# EAGLE design AD595_thermocouple_breakout_board (EAGLE 6.1)
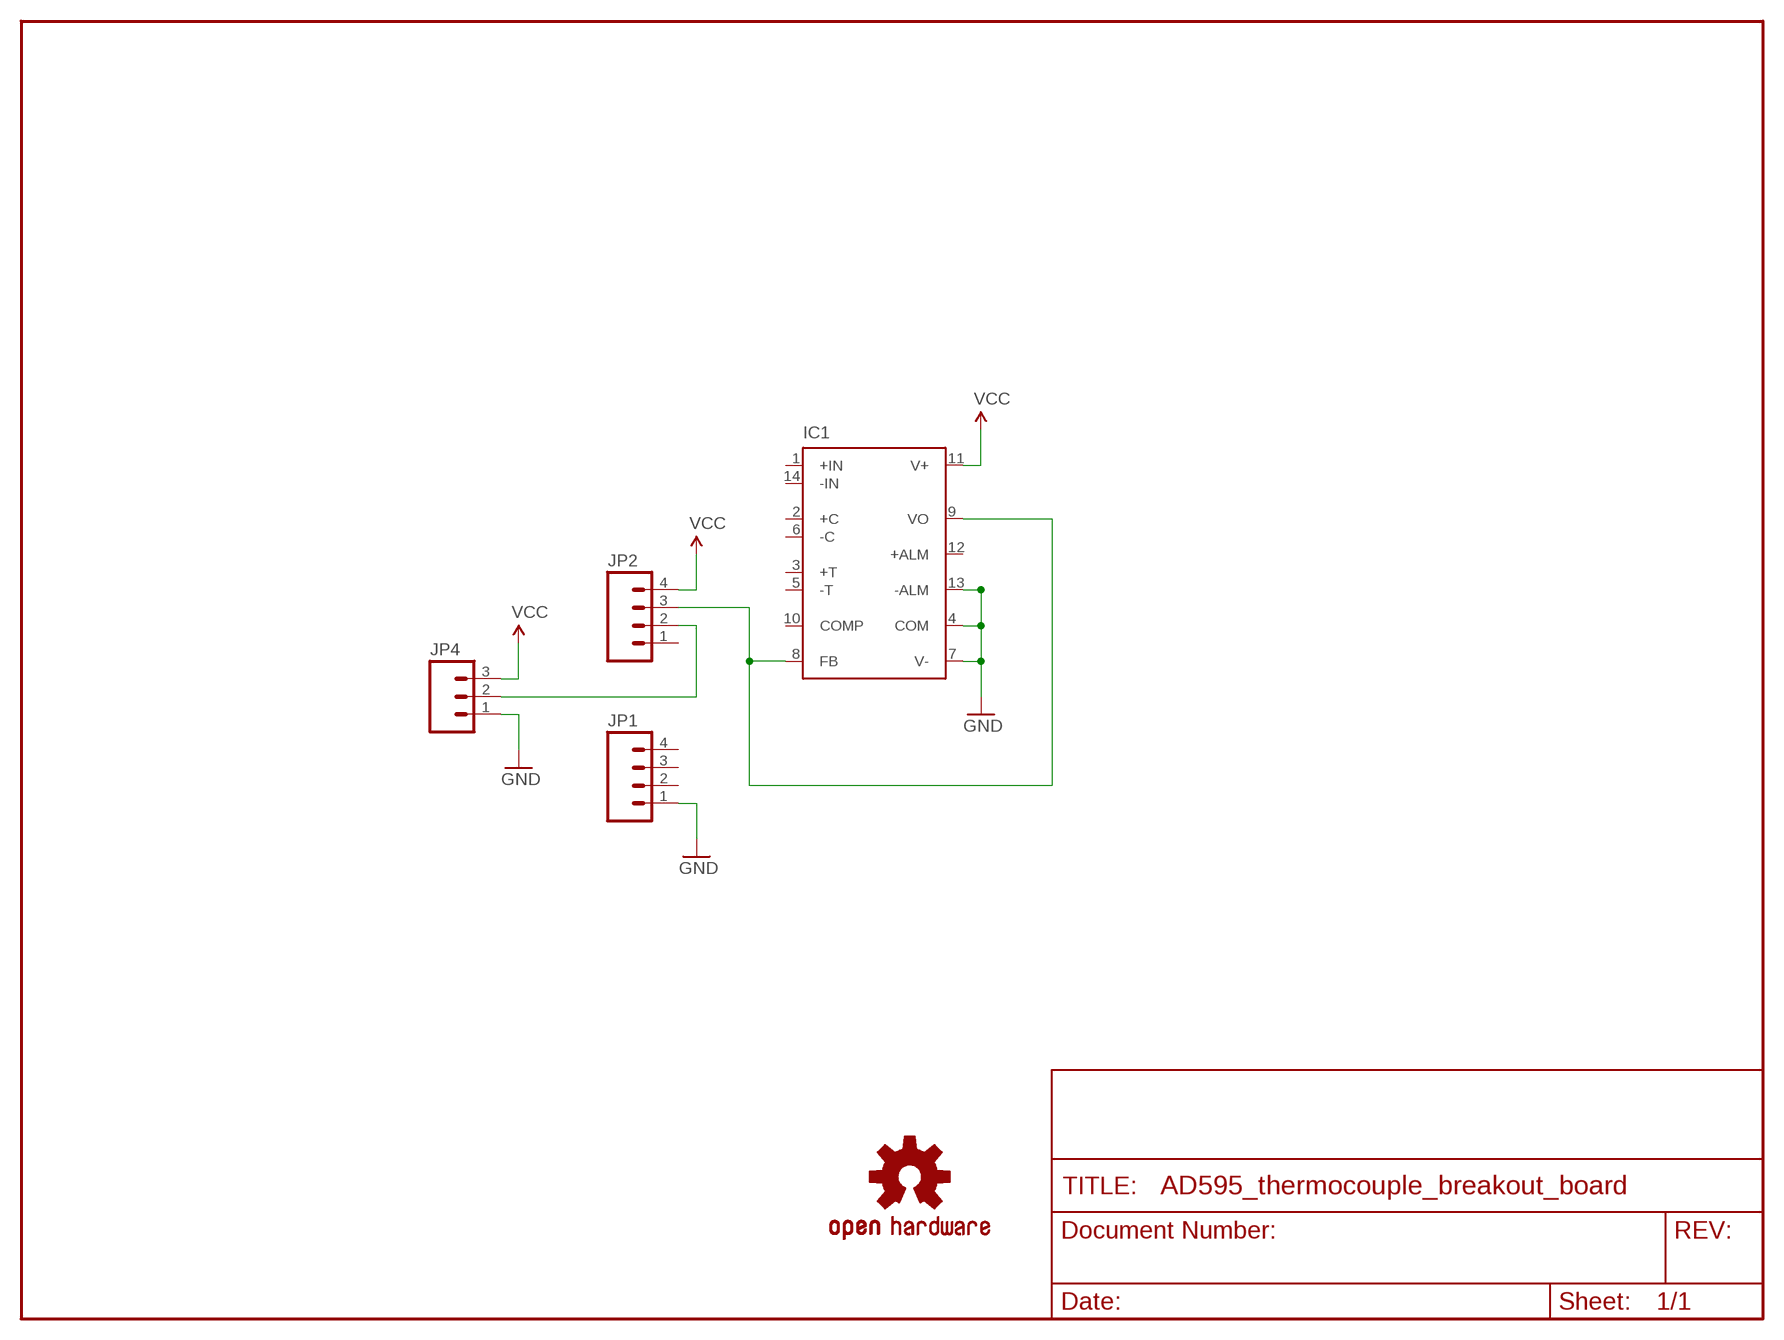
[diagram p0: schematic, sheet 1]

## Parts
IC1  AD595  [DIL14]
JP1  M04LOCK  [1X04_LOCK]
JP2  M04LOCK  [1X04_LOCK]
JP4  M03LOCK  [1X03_LOCK]
U$1  OSHW-LOGOS  [OSHW-LOGO-S]

## Nets
GND: IC1.4(COM) IC1.7(V-) IC1.13(-ALM) JP1.1 JP4.1
N$1: JP2.2 JP4.2
N$2: IC1.8(FB) IC1.9(VO) JP2.3
VCC: IC1.11(V+) JP2.4 JP4.3
Unconnected: IC1.1(+IN) IC1.2(+C) IC1.3(+T) IC1.5(-T) IC1.6(-C) IC1.10(COMP) IC1.12(+ALM) IC1.14(-IN) JP1.2 JP1.3 JP1.4 JP2.1

## Library data of the parts
IC1 = analog-devices:AD595: ANALOG DEVICES; MPN: AD595AQ; OC_FARNELL: 409194; OC_NEWARK: 06WX1596
JP1 JP2 = SparkFun:M04: Header 4 Standard 4-pin 0.1" header. Use with straight break away headers (SKU : PRT-00116), right angle break away headers (PRT-00553), swiss pins (PRT-00743), machine pins (PRT-00117), and female headers (PRT-00115). Molex polarized connector foot print use with SKU : PRT-08231 with associated crimp pins and housings. 1MM SMD Version SKU: PRT-10208
JP4 = SparkFun:M03: Header 3 Standard 3-pin 0.1" header. Use with straight break away headers (SKU : PRT-00116), right angle break away headers (PRT-00553), swiss pins (PRT-00743), machine pins (PRT-00117), and female headers (PRT-00115). Molex polarized connector foot print use with SKU : PRT-08232 with associated crimp pins and housings.
U$1 = SparkFun:OSHW-LOGO: Open Source Hardware Logo This logo indicates the piece of hardware it is found on incorporates a OSHW license and/or adheres to the definition of open source hardware found here: http://freedomdefined.org/OSHW

## Board
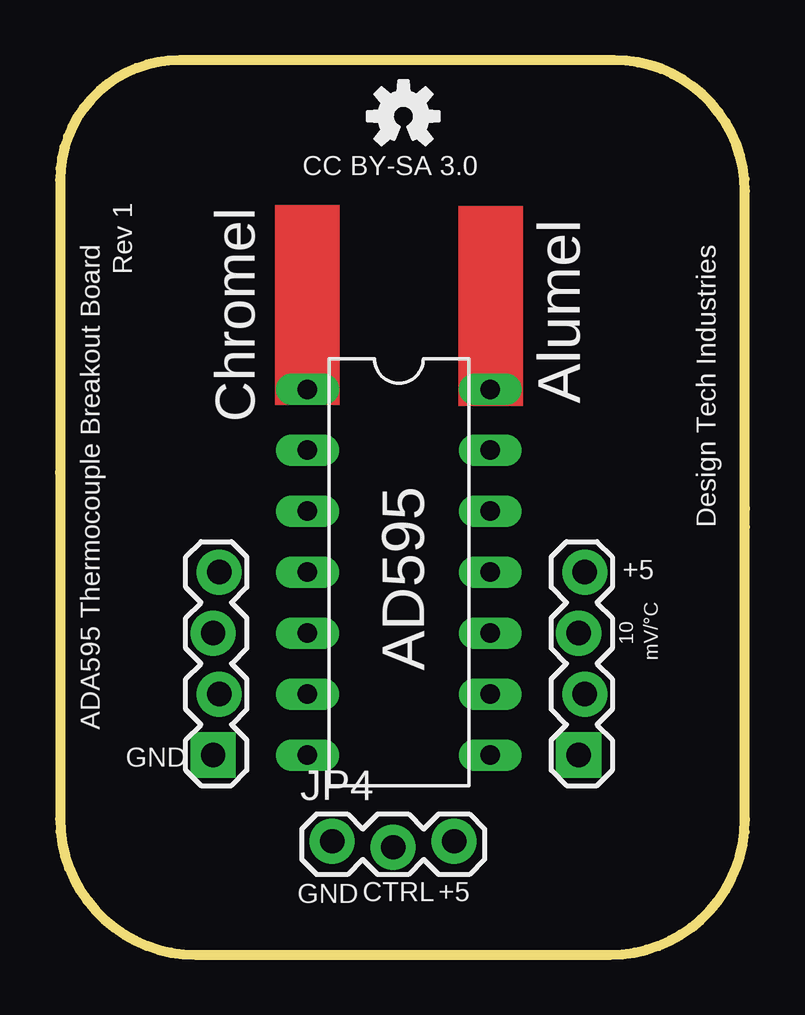
[diagram p1: board, top side]
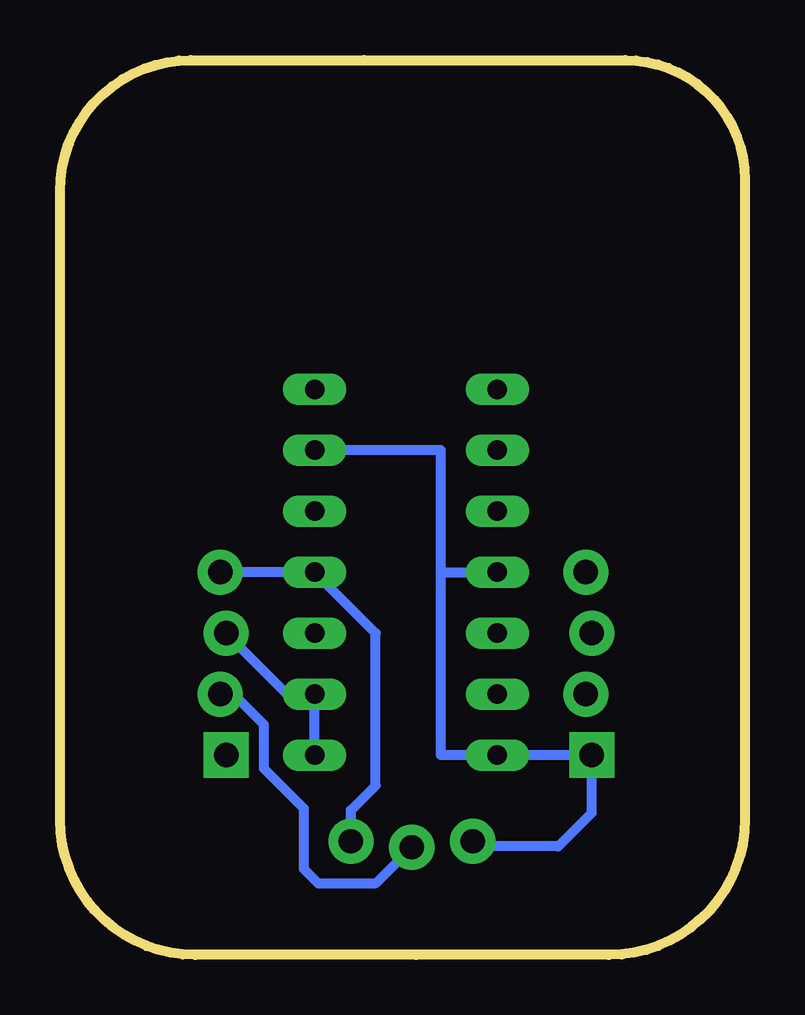
[diagram p2: board, bottom side, seen from below]

Size 28.56 x 37.29 mm. Coordinates in mm from the lower left corner, seen from the top.
Outline: 28.56,17.83 28.56,31.83 arc90 23.1,37.29 15.88,37.29
Outline: 15.88,37.29 4.99,37.29 arc90 0,32.3 0,20.11
Outline: 0,20.12 0,5.68 arc90 5.68,0 13.71,0
Outline: 13.7,0 22.92,0 arc90 28.56,5.64 28.56,18.6
Copper layers (1*16): Top 0.035mm / dielectric 1.5mm / Bottom 0.035mm
Design rules: minimum track width 10mil, minimum drill 24mil, track to track 8mil, track to pad 8mil, pad to pad 8mil, via to via 8mil, smd to smd 8mil, copper to edge 40mil, drill to drill 8mil, minimum pad ring 10mil, minimum via ring 8mil, stop-mask expansion 4mil, vias tented up to drill 0mil, thermal gap 10mil

### Footprints (pad centres in the part's own frame; a part is rotated, then mirrored left to right if it is on the bottom)
DIL14 = drill 0.813 long: 1 -7.62,-3.81; 2 -5.08,-3.81; 3 -2.54,-3.81; 4 0,-3.81; 5 2.54,-3.81; 6 5.08,-3.81; 7 7.62,-3.81; 8 7.62,3.81; 9 5.08,3.81; 10 2.54,3.81; 11 0,3.81; 12 -2.54,3.81; 13 -5.08,3.81; 14 -7.62,3.81
1X04_LOCK = drill 1.016 pad 1.88 square: 1 0,0.127 | drill 1.016 pad 1.88: 2 2.54,-0.127; 3 5.08,0.127; 4 7.62,-0.127
1X03_LOCK = drill 1.016 pad 1.88: 1 0,0.127; 2 2.54,-0.127; 3 5.08,0.127

### Placement (x,y rotation side)
IC1  14.13,15.95 270 top
JP1  6.51,8.33 90 top
JP2  21.75,8.33 90 top
JP4  11.35,4.61 0 top
U$1  14.32,34.94 0 top

### Tracks (layer width: path | path; a pad name or v marks a point on that pad's centre or on a via)
GND
  Bottom 0.406: IC1.13 12.68,21.03 12.68,15.95 | 12.68,15.95 IC1.4 | 12.68,15.95 12.68,8.33 IC1.7 JP1.1 6.39,5.92 7.78,4.52 11.13,4.52 JP4.1
N$1
  Bottom 0.406: JP2.2 21.33,10.87 20.05,9.6 20.05,7.76 18.39,6.1 18.39,3.57 17.79,2.97 15.41,2.97 JP4.2
N$2
  Bottom 0.406: IC1.8 IC1.9 19.09,10.87 JP2.3
VCC
  Bottom 0.406: JP2.4 IC1.11 15.4,13.41 15.4,7.06 16.43,6.03 JP4.3
(copper drawn outside any net)
  shapes: Top area x2

### Text on the board
tPlace: CC BY-SA 3.0 | Rev 1 | Alumel | Chromel | Design Tech Industries | +5 | 10 | mV/°C | AD595 | ADA595 Thermocouple Breakout Board | GND | GND | CTRL | +5